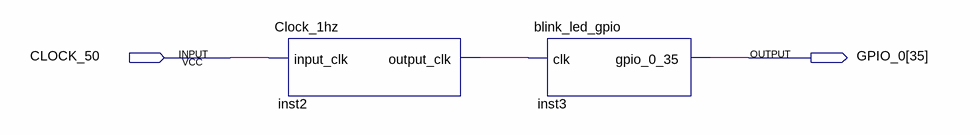
[diagram p0: schematic sheet]
// Quartus schematic Block3.bdf as structural Verilog: 2 symbols, 2 pins
module Block3 (
  input  CLOCK_50,
  output [35:35] GPIO_0
);

  wire inst2_output_clk;

  Clock_1hz inst2 (.input_clk(CLOCK_50), .output_clk(inst2_output_clk));
  blink_led_gpio inst3 (.clk(inst2_output_clk), .gpio_0_35(GPIO_0[35]));
endmodule
